# EAGLE design cascadence11 (EAGLE 9.1.2)
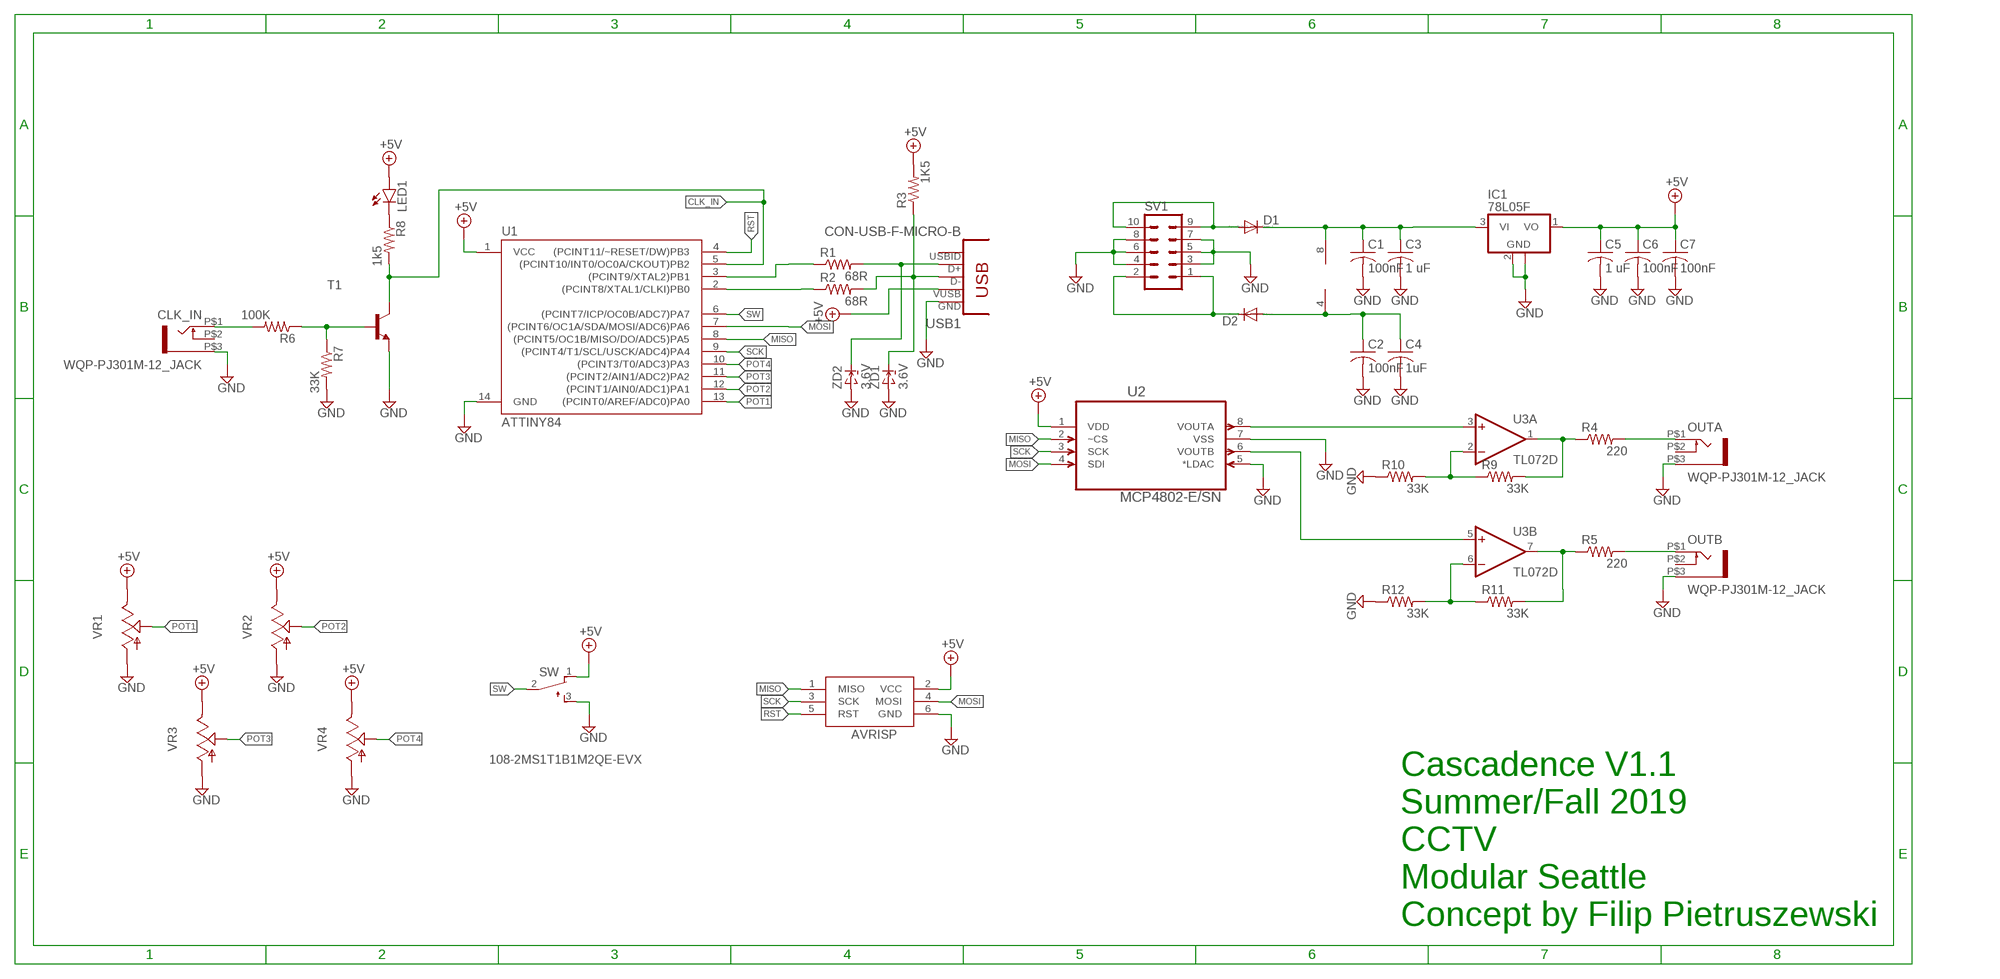
[diagram p0: schematic, sheet 1]

## Parts
AVRISP  AVRISP-6  [AVRISP]
C1  100nF  C-USC0805K  [C0805K]
C2  100nF  C-USC0805K  [C0805K]
C3  1 uF  C-USC1206  [C1206]
C4  1uF  C-USC1206  [C1206]
C5  1 uF  C-USC1206  [C1206]
C6  100nF  C-USC0805K  [C0805K]
C7  100nF  C-USC0805K  [C0805K]
CLK_IN  WQP-PJ301M-12_JACK  [WQP-PJ301M-12_JACK]
D1  DIODE-SMB  [SMB]
D2  DIODE-SMB  [SMB]
IC1  78L05F  [SOT89]
LED1  LED3MM  [LED3MM]
OUTA  WQP-PJ301M-12_JACK  [WQP-PJ301M-12_JACK]
OUTB  WQP-PJ301M-12_JACK  [WQP-PJ301M-12_JACK]
R1  68R  R-US_R0805W  [R0805W]
R2  68R  R-US_R0805W  [R0805W]
R3  1K5  R-US_R0805W  [R0805W]
R4  220  R-US_R0805W  [R0805W]
R5  220  R-US_R0805W  [R0805W]
R6  100K  R-US_R0805W  [R0805W]
R7  33K  R-US_R0805W  [R0805W]
R8  1k5  R-US_R0805W  [R0805W]
R9  33K  R-US_R0805W  [R0805W]
R10  33K  R-US_R0805W  [R0805W]
R11  33K  R-US_R0805W  [R0805W]
R12  33K  R-US_R0805W  [R0805W]
SV1  EURO_POWER_HEADERFAT_PADS  [EURO_PWR_HEADER_FAT]
SW  108-2MS1T1B1M2QE-EVX  TL32PO  [TL3XPO]
T1  MMBT3904LT1-NPN-SOT23-BEC  [SOT23-BEC]
U1  ATTINY84  [SO14]
U2  MCP4802-E/SN  MCP4812-E/SN  [SOIC127P600X175-8N]
U3  TL072D  [SO08]
USB1  CON-USB-F-MICRO-B  [CONN_USB_MICRO-B]
VR1  9MM_SNAP-IN_POT_  [9MM_SNAP-IN_POT]
VR2  9MM_SNAP-IN_POT_  [9MM_SNAP-IN_POT]
VR3  9MM_SNAP-IN_POT_  [9MM_SNAP-IN_POT]
VR4  9MM_SNAP-IN_POT_  [9MM_SNAP-IN_POT]
ZD1  3.6V  ZENERSOD-123  [SOD-123]
ZD2  3.6V  ZENERSOD-123  [SOD-123]

## Nets
+5V: AVRISP.2(VCC) C5.1 C6.1 C7.1 IC1.1(VO) LED1.A R3.2 SW.1(O) U1.1(VCC) U2.1(VDD) USB1.P1(VUSB) VR1.3(E) VR2.3(E) VR3.3(E) VR4.3(E)
CLK_IN: R8.2 T1.C U1.5((PCINT10/INT0/OC0A/CKOUT)PB2)
GND: AVRISP.6(GND) C1.2 C2.2 C3.2 C4.2 C5.2 C6.2 C7.2 CLK_IN.P$3 IC1.2(GND) IC1.2@1(GND) OUTA.P$3 OUTB.P$3 R7.2 R10.1 R12.1 SV1.3 SV1.4 SV1.5 SV1.6 SV1.7 SV1.8 SW.3(S) T1.E U1.14(GND) U2.5(*LDAC) U2.7(VSS) USB1.P5(GND) VR1.1(A) VR2.1(A) VR3.1(A) VR4.1(A) ZD1.A ZD2.A
MISO: AVRISP.1(MISO) U1.8((PCINT5/OC1B/MISO/DO/ADC5)PA5) U2.2(~CS)
MOSI: AVRISP.4(MOSI) U1.7((PCINT6/OC1A/SDA/MOSI/ADC6)PA6) U2.4(SDI)
N$1: R1.2 USB1.P3(D+) ZD2.C
N$2: R2.2 R3.1 USB1.P2(D-) ZD1.C
N$3: R2.1 U1.2((PCINT8/XTAL1/CLKI)PB0)
N$4: U2.8(VOUTA) U3.3(A:+IN)
N$5: R1.1 U1.3((PCINT9/XTAL2)PB1)
N$6: D2.C SV1.1 SV1.2
N$7: U2.6(VOUTB) U3.5(B:+IN)
N$8: R4.1 R9.2 U3.1(A:OUT)
N$9: R5.1 R11.2 U3.7(B:OUT)
N$10: CLK_IN.P$1 R6.2
N$11: OUTA.P$1 R4.2
N$12: OUTB.P$1 R5.2
N$13: R6.1 R7.1 T1.B
N$14: C2.1 C4.1 D2.A U3.4(P:V-)
N$15: LED1.K(C) R8.1
N$16: D1.A SV1.9 SV1.10
N$17: C1.1 C3.1 D1.C IC1.3(VI) U3.8(P:V+)
N$18: R9.1 R10.2 U3.2(A:-IN)
N$19: R11.1 R12.2 U3.6(B:-IN)
POT1: U1.13((PCINT0/AREF/ADC0)PA0) VR1.2(S)
POT2: U1.12((PCINT1/AIN0/ADC1)PA1) VR2.2(S)
POT3: U1.11((PCINT2/AIN1/ADC2)PA2) VR3.2(S)
POT4: U1.10((PCINT3/T0/ADC3)PA3) VR4.2(S)
RST: AVRISP.5(RST) U1.4((PCINT11/~RESET/DW)PB3)
SCK: AVRISP.3(SCK) U1.9((PCINT4/T1/SCL/USCK/ADC4)PA4) U2.3(SCK)
SW: SW.2(P) U1.6((PCINT7/ICP/OC0B/ADC7)PA7)
Unconnected: CLK_IN.P$2 OUTA.P$2 OUTB.P$2 USB1.BODY@1(BODY) USB1.BODY@2(BODY) USB1.BODY@3(BODY) USB1.BODY@4(BODY) USB1.P4(USBID)

## Notes on the sheet
- Cascadence V1.1
  Summer/Fall 2019
  CCTV
  Modular Seattle
  Concept by Filip Pietruszewski

## Library data of the parts
AVRISP = adafruit:AVRISP: AVR ISP HEADER Standard 6 pin header for AVR programming
C1-C7 = rcl:C-US: CAPACITOR, American symbol; SPICEPREFIX: C
CLK_IN OUTA OUTB = thonkiconn:WQP-PJ301M-12_JACK
D1 D2 = diode:DIODE-: DIODE
IC1 = linear:78L*: POSITOIV-VOLTAGE REGULATORS Output up to 100 mA Source: Datasheet <http://focus.ti.com/lit/ds/symlink/ua78l05.pdf>
LED1 = led:LED: LED OSRAM: - CHIPLED LG R971, LG N971, LY N971, LG Q971, LY Q971, LO R971, LY R971 LH N974, LH R974 LS Q976, LO Q976, LY Q976 LO Q996 - Hyper CHIPLED LW Q18S LB Q993, LB Q99A, LB R99A - SideLED LS A670, LO A670, LY A670, LG A670, LP A670 LB A673, LV A673, LT A673, LW A673 LH A674 LY A675 LS A676, LA A676, LO A676, LY A676, LW A676 LS A679, LY A679, LG A679 - Hyper Micro SIDELED® LS Y876, LA Y876, LO Y876, LY Y876 LT Y87S - SmartLED LW L88C, LW L88S LB L89C, LB L89S, LG L890 LS L89K, LO L89K, LY L89K LS L896, LA L896, LO L896, LY L896 - TOPLED LS T670, LO T670, LY T670, LG T670, LP T670 LSG T670, LSP T670, LSY T670, LOP T670, LYG T670 LG T671, LOG T671, LSG T671 LB T673, LV T673, LT T673, LW T673 LH T674 LS T676, LA T676, LO T676, LY T676, LB T676, LH T676, LSB T676, LW T676 LB T67C, LV T67C, LT T67C, LS T67K, LO T67K, LY T67K, LW E67C LS E67B, LA E67B, LO E67B, LY E67B, LB E67C, LV E67C, LT E67C LW T67C LS T679, LY T679, LG T679 LS T770, LO T770, LY T770, LG T770, LP T770 LB T773, LV T773, LT T773, LW T773 LH T774 LS E675, LA E675, LY E675, LS T675 LS T776, LA T776, LO T776, LY T776, LB T776 LHGB T686 LT T68C, LB T68C - Hyper Mini TOPLED® LB M676 - Mini TOPLED Santana® LG M470 LS M47K, LO M47K, LY M47K Source: http://www.osram.convergy.de LUXEON: - LUMILED® LXK2-PW12-R00, LXK2-PW12-S00, LXK2-PW14-U00, LXK2-PW14-V00 LXK2-PM12-R00, LXK2-PM12-S00, LXK2-PM14-U00 LXK2-PE12-Q00, LXK2-PE12-R00, LXK2-PE12-S00, LXK2-PE14-T00, LXK2-PE14-U00 LXK2-PB12-K00, LXK2-PB12-L00, LXK2-PB12-M00, LXK2-PB14-N00, LXK2-PB14-P00, LXK2-PB14-Q00 LXK2-PR12-L00, LXK2-PR12-M00, LXK2-PR14-Q00, LXK2-PR14-R00 LXK2-PD12-Q00, LXK2-PD12-R00, LXK2-PD12-S00 LXK2-PH12-R00, LXK2-PH12-S00 LXK2-PL12-P00, LXK2-PL12-Q00, LXK2-PL12-R00 Source: www.luxeon.com KINGBRIGHT: KA-3528ASYC Source: www.kingbright.com
R1-R12 = rcl:R-US_: RESISTOR, American symbol; SPICEPREFIX: R
SV1 = MusicThingModular:EURO_POWER_HEADER: Power Header 10 pin power header for Eurorack Power Supplies Variants with fatter pads for easier soldering, and the LOCK variant which has 5mil offset pins to hold the component in place before soldering
SW = switch:TL32PO: TINY SWITCH ON - MOM Source: http://www2.produktinfo.conrad.com/datenblaetter/700000-724999/705152-da-01-de-Subminiaturschalter_TL_36YO.pdf
T1 = MusicThingModular:*-NPN-: NPN Transistror BF959 corrected 2008.03.06
U1 = SparkFun-IC-Microcontroller:ATTINY84: Atmel 14-pin 2/4/8kB flash uC Datasheet <https://cdn.sparkfun.com/datasheets/Widgets/doc8006.pdf> SparkFun Products Tiny AVR Programmer <https://www.sparkfun.com/products/11801> (PGM-11801) SparkFun Servo Trigger - Continuous Rotation <https://www.sparkfun.com/products/13872> (WIG-13872) SparkFun Servo Trigger <https://www.sparkfun.com/products/13118> (WIG-13118); PROD_ID: IC-11285
U2 = MCP4812-E_SN:MCP4812-E/SN: DAC 10BIT DUAL SPI/VREF; AVAILABILITY: Unavailable; DESCRIPTION: MCP4812 Series 2 Ch 10-bit SPI Interface Digital-to-Analog Converter - SOIC-8; MF: Microchip; MP: MCP4812-E/SN; PACKAGE: SOIC-8 Microchip; PRICE: None
U3 = linear:TL072: OP AMP
USB1 = dp_devices:CON-USB-F: USB Female connector
VR1-VR4 = MusicThingModular:9MM_SNAP-IN_POT: 9mm vertical snap-in pot, Alpha / Panasonic style
ZD1 ZD2 = dp_devices:ZENER: Zener Diode SOD-323

## Net classes
0 default: width 0.305 mm, drill 0.254 mm, clearance 0.203 mm

## Board
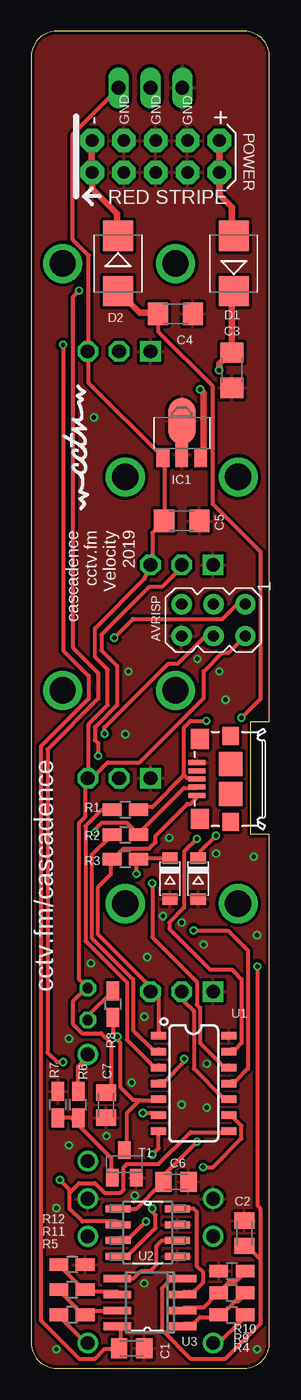
[diagram p1: board, top side]
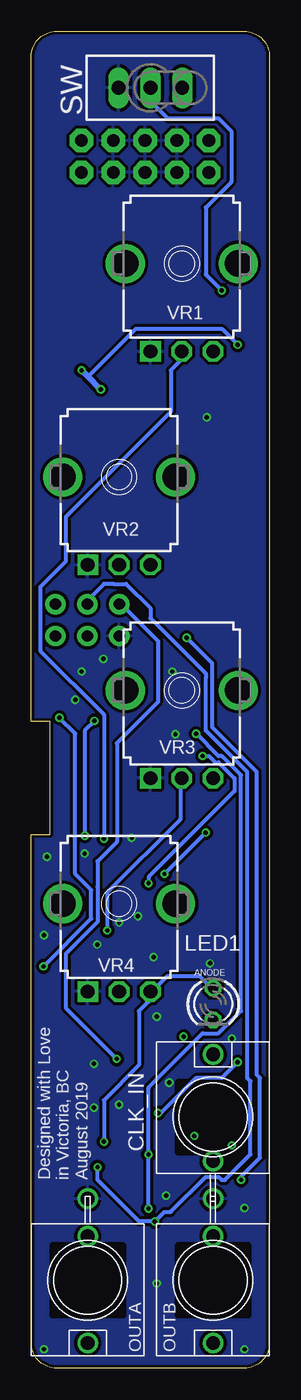
[diagram p2: board, bottom side, seen from below]

Size 19 x 106.5 mm. Coordinates in mm from the lower left corner, seen from the top.
Outline: 0,104.5 0,2 arc90 2,0 17,0 arc90 19,2 19,42.5 17.5,42.5 17.5,51.5 19,51.5 19,104.5 arc90 17,106.5 2,106.5 arc90 0,104.5
Copper layers (1*16): Top 0.035mm / dielectric 1.5mm / Bottom 0.035mm
Design rules "dirt_cheap_dirty_boards.v1": minimum track width 5mil, minimum drill 12mil, track to track 5mil, track to pad 5mil, pad to pad 5mil, via to via 5mil, smd to smd 0mil, copper to edge 10mil, drill to drill 10mil, minimum pad ring 10mil, minimum via ring 6mil, stop-mask expansion 2mil, vias tented up to drill 25mil, thermal gap 10mil

### Footprints (pad centres in the part's own frame; a part is rotated, then mirrored left to right if it is on the bottom)
AVRISP = drill 0.9 pad 1.626: 1 -1.27,2.54; 2 1.27,2.54; 3 -1.27,0; 4 1.27,0; 5 -1.27,-2.54; 6 1.27,-2.54
C0805K = smd 1.3 x 1.6: 1 -1,0; 2 1,0
C1206 = smd 1.6 x 1.8: 1 -1.4,0; 2 1.4,0
WQP-PJ301M-12_JACK = drill 1.1: P$1 0,5; P$2 0,-3.5; P$3 0,-6.5
SMB = smd 2.4 x 2.4: A 2.2,0; C -2.2,0
SOT89 = smd 1 x 1.5: 1 -1.499,-1.981; 3 1.499,-1.981 | smd 1 x 2: 2 0,-1.727 | smd 2.2 x 3.7: 2@1 0,0.94
LED3MM = drill 0.813 octagon: A -1.27,0; K 1.27,0
R0805W = smd 1.5 x 1: 1 -1.052,0; 2 1.052,0
EURO_PWR_HEADER_FAT = drill 1.016 pad 1.88 octagon: 1 -5.08,-1.27; 2 -5.08,1.27; 3 -2.54,-1.27; 4 -2.54,1.27; 5 0,-1.27; 6 0,1.27; 7 2.54,-1.27; 8 2.54,1.27; 9 5.08,-1.27; 10 5.08,1.27
TL3XPO = drill 1.1 pad 1.422 long: 1 -2.54,0; 2 0,0; 3 2.54,0
SOT23-BEC = smd 1 x 1.4: B -0.95,-1.1; C 0,1.1; E 0.95,-1.1
SO14 = smd 0.6 x 1.2: 1 -3.175,-2.8; 2 -1.905,-2.8; 3 -0.635,-2.8; 4 0.635,-2.8; 5 1.905,-2.8; 6 3.175,-2.8; 7 4.445,-2.8; 8 4.445,2.8; 9 3.175,2.8; 10 1.905,2.8; 11 0.635,2.8; 12 -0.635,2.8; 13 -1.905,2.8; 14 -3.175,2.8
SOIC127P600X175-8N = smd 1.981 x 0.559: 1 -2.362,1.905; 2 -2.362,0.635; 3 -2.362,-0.635; 4 -2.362,-1.905; 5 2.362,-1.905; 6 2.362,-0.635; 7 2.362,0.635; 8 2.362,1.905
SO08 = smd 0.6 x 2.2: 1 -1.905,-2.6; 2 -0.635,-2.6; 3 0.635,-2.6; 4 1.905,-2.6; 5 1.905,2.6; 6 0.635,2.6; 7 -0.635,2.6; 8 -1.905,2.6
CONN_USB_MICRO-B = smd 1.6 x 1.4: BODY@1 -3.2,2.45; BODY@2 3.2,2.45 | smd 1.45 x 1.3: BODY@3 3.425,0; BODY@6 -3.425,0 | smd 1.9 x 1.9: BODY@4 1.2,0; BODY@5 -1.2,0 | smd 0.4 x 1.35: P1 -1.3,2.675; P2 -0.65,2.675; P3 0,2.675; P4 0.65,2.675; P5 1.3,2.675
9MM_SNAP-IN_POT = drill 1.1 square: 1 -2.5,-7 | drill 1.1 octagon: 2 0,-7; 3 2.5,-7 | drill 2.1 pad 2.794: CHASSIS1 -4.5,0; CHASSIS2 4.5,0
SOD-123 = smd 0.91 x 1.22: A 1.635,0; C -1.635,0

### Placement (x,y rotation side)
AVRISP  14.53,59.6 270 top
C1  8,1.6 0 top
C2  17,10.75 90 top
C3  16,79.5 270 top
C4  11.5,84 0 top
C5  12,67.5 0 top
C6  11.54,14.84 0 top
C7  5.96,20.96 270 top
CLK_IN  4.5,20 0 bottom
D1  16.14,88 90 top
D2  6.91,88 270 top
IC1  12,74.5 0 top
LED1  4.5,29 270 bottom
OUTA  14.5,7 180 bottom
OUTB  4.5,7 180 bottom
R1  7.5,44.5 0 top
R2  7.5,42.5 0 top
R3  7.5,40.54 180 top
R4  16,4.25 0 top
R5  3.25,4.25 180 top
R6  3.74,21 90 top
R7  2.13,21 90 top
R8  6.5,29 270 top
R9  16,6 0 top
R10  16,7.75 0 top
R11  3.25,6.25 180 top
R12  3.25,8.25 180 top
SV1  9.92,96.54 0 top
SW  9.5,102 180 bottom
T1  7.41,16.27 0 top
U1  12.96,23.32 270 top
U2  9.29,10.8 0 top
U3  9.47,5.24 90 top
USB1  15.9,46.94 90 top
VR1  7,88 0 bottom
VR2  12,71 0 bottom
VR3  7,54 0 bottom
VR4  12,37 0 bottom
ZD1  11.06,39 270 top
ZD2  13.31,39 270 top

### Tracks (layer width: path | path; a pad name or v marks a point on that pad's centre or on a via)
+5V  (via drill 0.35)
  Top 0.305: SW.1 6.86,101.85 3.3,98.3 3.3,89.92 4.57,88.65 4.57,81.03 VR1.3 4.57,80.77 4.57,78.49 10.41,72.64 IC1.1 10.67,72.39 10.67,67.56 C5.1 10.41,67.31 9.65,66.55 9.65,64.01 VR2.3 9.04,62.9 5.08,58.94 5.08,56.66 6.09,55.65 6.09,52.82 4.57,51.31 4.57,47.24 | 4.57,47.24 5.08,47.24 6.1,48.26 8.64,48.26 13.75,53.37 13.75,55.5 15.25,57 15.75,57 AVRISP.2 | 4.57,47.24 VR3.3 | USB1.P1 13.21,45.47 12.7,44.96 12.45,44.96 9.91,42.42 9.91,41.91 9.4,41.4 7.37,41.4 6.6,40.64 R3.2 6.35,40.39 6.35,39.36 5.33,38.34 5.33,34.54 9.65,30.23 VR4.3 9.65,29.97 10.16,29.46 10.16,26.67 U1.1 | v13.21,18.03 10.67,15.49 10.67,14.99 C6.1 10.41,14.73 10.4,14.73 8.37,12.7 U2.1 | VR3.3 4.32,46.99 4.32,43.94 3.81,43.43 3.81,30.99 4.32,30.48 LED1.A 4.32,30.23 3.3,29.21 3.3,27.43 4.06,26.67 5.57,26.67 6.34,25.9 6.34,22.34 C7.1 | 4.57,47.24 VR3.3
  Bottom 0.305: v13.21,18.03 13.21,21.35 10.41,24.15 10.41,28.45 9.65,29.21 9.65,29.97 VR4.3 9.4,29.97 8.13,31.24 5.59,31.24 4.83,30.48 4.57,30.48 LED1.A
CLK_IN  (via drill 0.35)
  Top 0.305: 8.64,21.34 10.16,21.34 U1.5 | 8.64,21.34 7.62,20.32 7.62,17.53 T1.C | 8.64,21.34 8.16,21.34 7.12,22.38 7.12,25.91 6.86,26.17 v6.86,26.42 6.5,26.77 R8.2
GND  (via drill 0.35)
  other vias: 9.25,32.75 4.75,32.25 9,28 12,21 14,20.75 2,12.75 9,6.75 6,18.5 3,17.75 8,22.75 8.25,13.75 3,26.25 15.5,53.25 14.75,41 17.75,40.75 18,34.5 10.5,36 13.75,33.75 15,55.5 7.5,50.5 12,35.5 5,75.75 7.75,55.5 13.25,56.5 11,42.25 14,24.25 2,1.5 18,1.5
  pour Top (isolate 0.254): 19,104.5 19,2 arc-90 17,0 2,0 arc-90 0,2 0,104.5 arc-90 2,106.5 17,106.5 arc-90
  pour Bottom (isolate 0.254): 1,-7 arc-90 0,-6 0,104.5 arc-90 2,106.5 17.5,106.5 arc-90 19.5,104.5 19.5,-7
MISO  (via drill 0.35)
  Top 0.305: 3.05,14.22 3.05,12.7 4.07,11.68 6.86,11.68 U2.2 | 3.05,14.22 3.05,13.97 3.81,14.73 5.08,14.73 5.84,13.97 7.11,13.97 7.37,14.22 7.37,16 7.62,16.26 10.16,16.26 12.7,18.8 15.75,18.8 U1.8 | v6.6,58.18 8.11,59.69 15.24,59.69 16.26,60.71 17.02,60.71 AVRISP.1 | 3.05,14.22 v2.27,15
  Bottom 0.305: v2.27,15 2.27,15.25 0.76,16.76 0.76,23.11 1.02,23.37 1.02,47.5 4.57,51.05 4.57,56.14 v6.6,58.17 v6.6,58.18
MOSI  (via drill 0.35)
  Top 0.305: v9.65,17.02 10.16,17.53 10.16,18.8 U1.7 | v9.65,12.71 9.65,12.45 9.91,12.19 9.91,11.18 7.62,8.89 U2.4 | v5.84,50.55 5.84,51.05 10.92,56.13 11.68,56.13 13.72,58.17 14.48,58.17 AVRISP.4
  Bottom 0.305: v9.65,12.71 v9.65,17.02 9.65,22.35 5.33,26.67 4.06,26.67 2.29,28.45 2.29,47.24 3.81,48.77 4.06,48.77 v5.84,50.55
N$1  (via drill 0.35)
  Top 0.305: v14.73,42.42 13.46,41.15 13.46,40.64 ZD2.C | v13.97,51.56 12.7,51.56 12.19,51.05 12.19,47.24 | 12.19,47.24 12.45,46.99 13.21,46.99 USB1.P3 | 12.19,47.24 9.65,44.7 8.64,44.7 R1.2
  Bottom 0.305: v14.73,42.42 14.73,50.8 v13.97,51.56
N$2  (via drill 0.35)
  Top 0.305: ZD1.C 10.92,40.64 8.64,40.64 R3.1 8.38,40.39 v8.38,39.37 | USB1.P2 13.21,46.23 12.19,46.23 8.64,42.67 R2.2 8.38,42.67 7.62,43.43 5.59,43.43 5.08,42.93 v5.08,42.67
  Bottom 0.305: v5.08,42.67 v8.38,39.37
N$3
  Top 0.305: U1.2 10.16,25.4 9.65,25.4 8.13,26.92 8.13,30.99 4.83,34.29 4.83,40.89 6.35,42.42 R2.1
N$4
  Top 0.305: U2.8 11.68,12.7 12.94,12.7 13.21,12.43 13.21,8.13 13.72,7.62 13.72,6.86 12.95,6.1 12.19,6.1 U3.3
N$5
  Top 0.305: U1.3 10.16,24.13 9.65,24.13 7.62,26.16 7.62,30.73 4.32,34.04 4.32,43.18 5.59,44.45 6.35,44.45 R1.1
N$6
  Top 0.305: 6.86,90.42 D2.C | 4.83,97.79 SV1.2 | 4.83,95.5 SV1.1
  Top 0.508: 6.86,90.42 6.86,91.97 4.84,93.99 SV1.1 | 4.83,95.5 4.83,97.79
N$7
  Top 0.305: U2.6 11.43,10.16 10.41,10.16 10,9.75 10,8.25 9.5,7.75 8.75,7.75 8.14,7.14 U3.5
N$8
  Top 0.305: U3.1 12.19,3.56 12.95,3.56 13.46,4.06 14.73,4.06 R4.1 14.99,4.06 16.26,5.33 16.51,5.33 17.02,5.84 R9.2
N$9
  Top 0.305: R11.2 2.29,6.1 4.06,4.32 R5.1 4.32,4.32 4.57,4.57 6.86,4.57 U3.7
N$10
  Top 0.305: CLK_IN.P$1 4.57,24.89 3.74,24.06 R6.2
N$11
  Top 0.305: R4.2 17.02,4.06 14.73,1.78 OUTA.P$1
N$12
  Top 0.305: R5.2 2.29,4.06 4.32,2.03 OUTB.P$1
N$13
  Top 0.305: T1.B 6.35,15.24 6.35,16.77 3.17,19.95 R7.1 R6.1
N$14  (via drill 0.35)
  Top 0.305: 9.91,84.07 C4.1 10.16,83.82 10.16,82.55 14.48,78.23 14.48,68.83 18.29,65.02 18.29,53.34 v16.76,51.82 | 7.11,85.6 D2.A | 18.29,8.64 17.22,9.7 C2.1 | 18.29,8.64 18.29,3.56 15.49,0.76 12.7,0.76 10.41,3.05 10.41,6.35 11.18,7.11 11.94,7.11 U3.4 | 18.29,8.64 18.25,8.67 18.25,12.75 18.03,12.97 v18.03,32
  Top 0.508: 9.91,84.07 8.64,84.07 7.11,85.6
  Bottom 0.305: v16.76,51.82 15.49,50.55 15.49,39.37 14.22,38.1 14.22,35.82 v18.03,32
N$15
  Top 0.305: LED1.K 4.57,27.8 4.57,28.12 R8.1
N$16
  Top 0.305: 16,90.42 D1.A | 14.99,97.79 SV1.10 | 14.99,95.5 SV1.9
  Top 0.508: 16,90.42 16,92.49 15,93.49 SV1.9 | 14.99,95.5 14.99,97.79
N$17  (via drill 0.35)
  Top 0.305: U3.8 7.11,3.3 7.11,1.78 C1.1 6.86,1.52 5.84,1.52 5.08,0.76 3.81,0.76 0.76,3.81 0.76,49.53 4.57,53.34 4.57,55.15 2.54,57.18 v2.54,81.53 | 15.75,80.77 C3.1 16,81.03 | 16,85.6 D1.C
  Top 0.508: v14.99,79.5 14.99,80.01 15.75,80.77 | 16,81.03 16,85.6 | v13.46,77.98 13.71,77.73 13.71,72.73 IC1.3
  Bottom 0.305: v2.54,81.53 3.81,82.8 10.67,82.8 14.48,78.99
  Bottom 0.508: v14.99,79.5 14.48,78.99 v13.46,77.98
N$18
  Top 0.305: R10.2 17.02,7.62 16.26,6.86 15.75,6.86 14.99,6.1 R9.1 14.73,5.84 13.72,4.83 12.19,4.83 U3.2
N$19
  Top 0.305: U3.6 6.86,6.1 4.32,6.1 R11.1 4.06,6.35 2.29,8.13 R12.2
POT1  (via drill 0.35)
  Top 0.305: v13.21,42.16 12.19,41.15 12.19,36.69 11,35.5 11,35 14.25,31.75 16,31.75 16.76,30.99 16.76,25.91 16.26,25.4 16,25.4 U1.13
  Bottom 0.305: v13.21,42.16 13.21,52.07 18.29,57.15 18.29,62.23 16.26,64.26 16.26,67.82 7.87,76.2 7.87,79.5 7.11,80.26 7.11,80.77 VR1.2
POT2  (via drill 0.35)
  Top 0.305: v9.65,38.62 9.65,34.33 13.21,30.78 13.21,28.96 13.46,28.7 13.46,25.91 15.24,24.13 15.75,24.13 U1.12 | v5.33,48.77 5.33,49.78 5.08,50.04 5.08,51.05 6.85,52.82 6.85,55.92 5.59,57.17 5.59,58.44 9.39,62.24 10.42,62.24 11.94,63.75 VR2.2
  Bottom 0.305: v5.33,48.77 4.83,48.77 4.32,48.26 4.06,48.26 2.79,46.99 2.79,45.98 9.65,39.12 v9.65,38.62
POT3  (via drill 0.35)
  Top 0.305: U1.11 16,22.86 16.26,22.86 17.27,23.88 17.27,33.27 15.68,34.87 v12.95,34.87
  Bottom 0.305: VR3.2 7.11,46.99 7.11,43.73 12.95,37.89 v12.95,34.87
POT4
  Top 0.305: U1.10 15.75,21.59 15.24,21.59 12.95,23.88 12.95,28.45 12.19,29.21 12.19,29.97 VR4.2
RST  (via drill 0.35)
  Top 0.305: v12.19,24.64 12.19,24.38 10.67,22.86 10.16,22.86 U1.4
  Bottom 0.305: v12.19,24.64 16.26,28.7 16.26,33.02 13.71,35.56 13.71,38.36 13.72,38.36 13.72,40.39 12.18,41.93 12.18,49.8 8.89,53.09 8.89,57.91 11.94,60.96 AVRISP.5
SCK  (via drill 0.35)
  Top 0.305: v13.72,16 14.48,16 16.76,18.29 16.76,19.3 16,20.07 U1.9 | v9.14,11.68 7.87,10.41 7.11,10.41 U2.3
  Bottom 0.305: AVRISP.3 14.48,60.96 14.48,61.21 13.21,62.48 12.45,62.48 12.44,62.49 11.43,62.49 9.5,60.56 9.5,59.75 5.08,55.33 5.08,55 5.08,50.8 1.78,47.5 1.78,23.11 1.52,22.86 1.52,17.02 3.56,14.99 3.81,14.99 4.06,15.24 5.08,15.24 7.89,12.43 8.39,12.43 v9.14,11.68 10.4,11.68 13.72,15 v13.72,16
SW  (via drill 0.35)
  Top 0.305: v8.89,20.32 10.16,20.32 U1.6 | v3.81,85.85 3.3,85.34 3.3,57.43 5.33,55.4 5.33,53.34 1.29,49.3 1.29,25.13 2.04,24.38 v2.54,24.38
  Bottom 0.305: v2.54,24.38 3.81,23.11 5.87,23.11 8.66,20.32 v8.89,20.32 | v3.81,85.85 5.08,87.12 5.08,92.46 3.05,94.49 3.05,98.55 4.06,99.57 8.13,99.57 9.4,100.84 9.4,101.85 SW.2

### Text on the board
tNames: cascadence / cctv.fm / Velocity / 2019 | cctv.fm/cascadence
bNames: ANODE | Designed with Love / in Victoria, BC / August 2019
tStop: github.com/cctvfm/cascadence